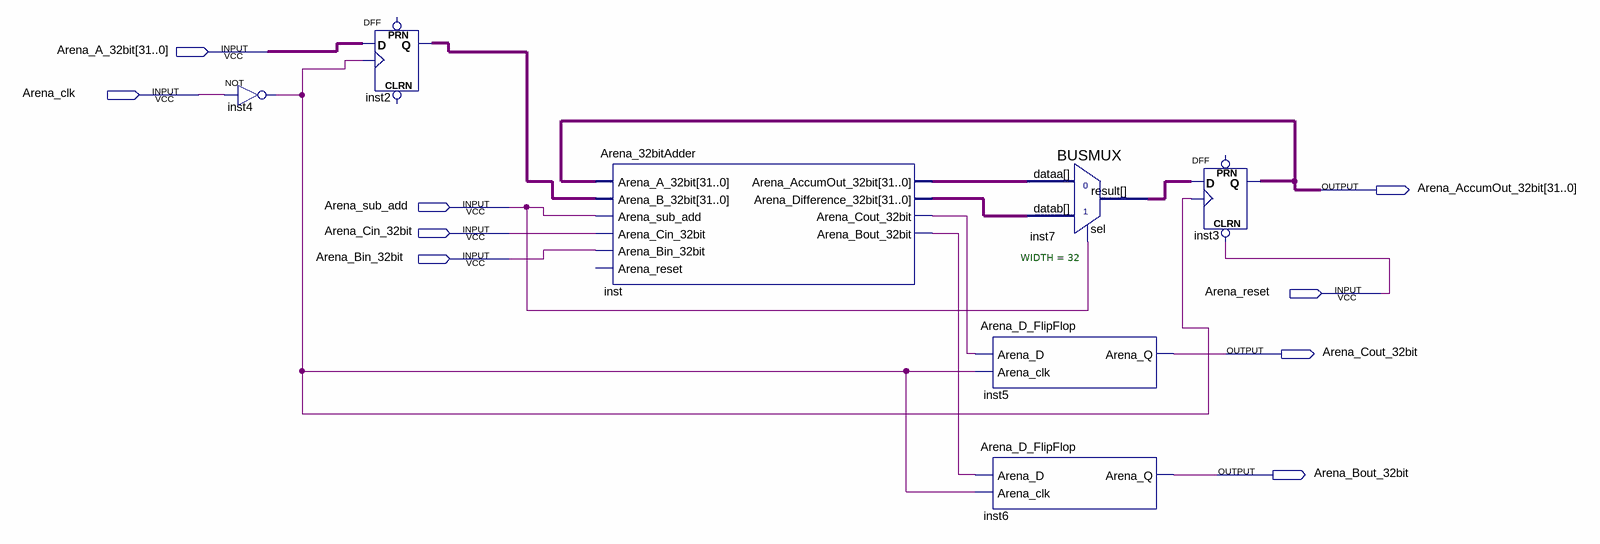
[diagram p0: schematic sheet]
// Quartus schematic Arena_32bitAccumulator.bdf as structural Verilog: 7 symbols, 9 pins
module Arena_32bitAccumulator (
  input  [31:0] Arena_A_32bit,
  input  Arena_clk,
  input  Arena_sub_add,
  input  Arena_Cin_32bit,
  input  Arena_Bin_32bit,
  input  Arena_reset,
  output [31:0] Arena_AccumOut_32bit,
  output Arena_Cout_32bit,
  output Arena_Bout_32bit
);

  wire inst4_out, inst_arena_bout_32bit, inst_arena_cout_32bit;
  wire [31:0] inst2_q, inst7_result, inst_arena_accumout_32bit, inst_arena_difference_32bit;

  not inst4 (inst4_out, Arena_clk);
  DFF inst2[31:0] (.CLK(inst4_out), .D(Arena_A_32bit), .Q(inst2_q));  // open: CLRN, PRN
  Arena_32bitAdder inst (
    .Arena_A_32bit(Arena_AccumOut_32bit), .Arena_B_32bit(inst2_q), .Arena_sub_add(Arena_sub_add),
    .Arena_Cin_32bit(Arena_Cin_32bit), .Arena_Bin_32bit(Arena_Bin_32bit),
    .Arena_AccumOut_32bit(inst_arena_accumout_32bit), .Arena_Difference_32bit(inst_arena_difference_32bit),
    .Arena_Cout_32bit(inst_arena_cout_32bit), .Arena_Bout_32bit(inst_arena_bout_32bit));  // open: Arena_reset
  Arena_D_FlipFlop inst5 (.Arena_D(inst_arena_cout_32bit), .Arena_clk(inst4_out), .Arena_Q(Arena_Cout_32bit));
  Arena_D_FlipFlop inst6 (.Arena_D(inst_arena_bout_32bit), .Arena_clk(inst4_out), .Arena_Q(Arena_Bout_32bit));
  BUSMUX #(.WIDTH(32)) inst7 (
    .datab(inst_arena_difference_32bit), .sel(Arena_sub_add), .dataa(inst_arena_accumout_32bit),
    .result(inst7_result));
  DFF inst3[31:0] (.CLRN(Arena_reset), .CLK(inst4_out), .D(inst7_result), .Q(Arena_AccumOut_32bit));  // open: PRN
endmodule
